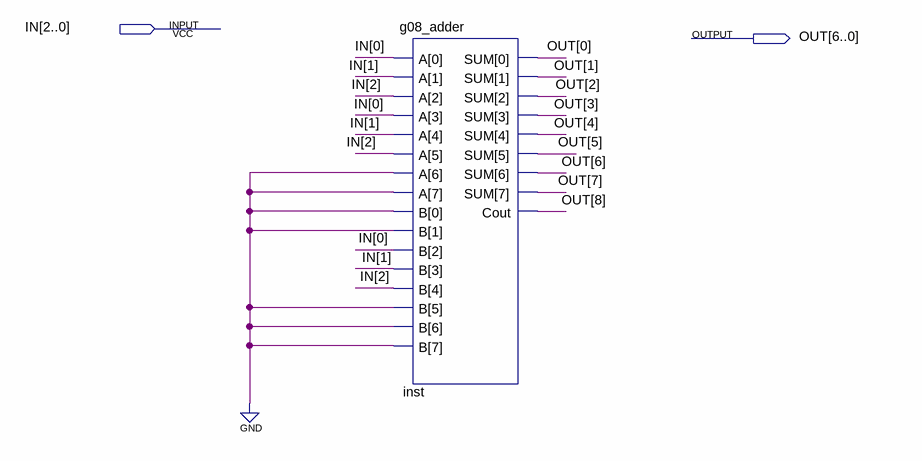
[diagram p0: schematic sheet]
// Quartus schematic TIME13.bdf as structural Verilog: 1 symbols, 2 pins
module TIME13 (
  input  [2:0] IN,
  output [8:0] OUT
);

  g08_adder inst (.A({2'b00, IN, IN}), .B({3'b000, IN, 2'b00}), .SUM(OUT[7:0]), .Cout(OUT[8]));
endmodule
